# EAGLE schematic 6_channel_esp32_energy_meter_add-on (EAGLE 9.6.0)
CNAME: ATM90E32; CREVISION: 1.3 rev.1; DESIGNER: John deGlavina

## Sheet 1 of 3
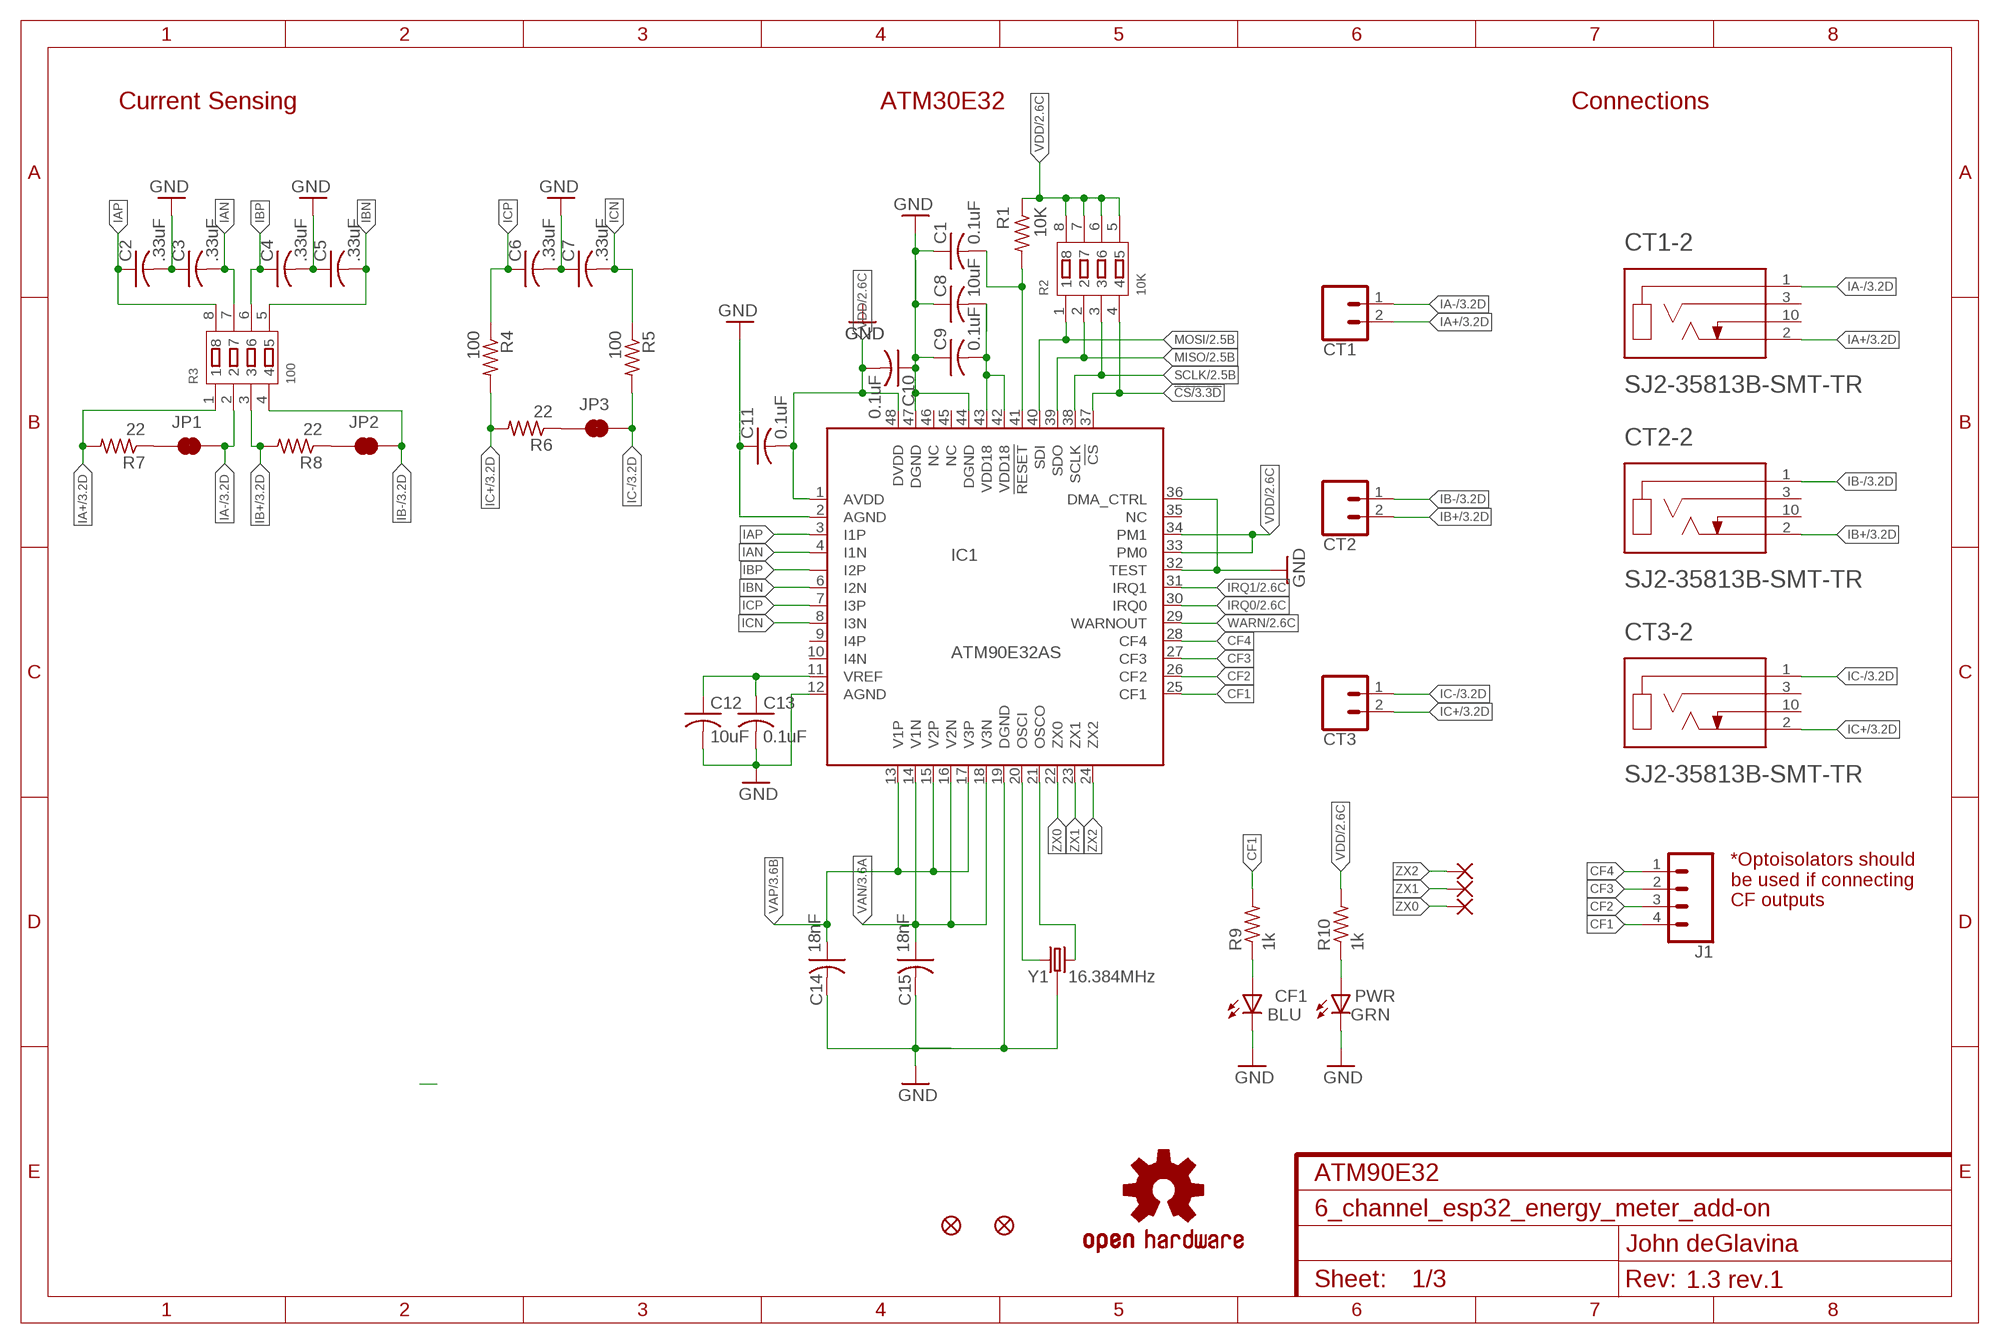
[diagram p0: schematic, sheet 1]

### Parts
C1  0.1uF  C-USC0603  [C0603]
C2  .33uF  C-USC0603  [C0603]
C3  .33uF  C-USC0603  [C0603]
C4  .33uF  C-USC0603  [C0603]
C5  .33uF  C-USC0603  [C0603]
C6  .33uF  C-USC0603  [C0603]
C7  .33uF  C-USC0603  [C0603]
C8  10uF  C-USC0603  [C0603]
C9  0.1uF  C-USC0603  [C0603]
C10  0.1uF  C-USC0603  [C0603]
C11  0.1uF  C-USC0603  [C0603]
C12  10uF  C-USC0603  [C0603]
C13  0.1uF  C-USC0603  [C0603]
C14  18nF  C-USC0603  [C0603]
C15  18nF  C-USC0603  [C0603]
CF1  BLU  LEDCHIPLED_0603  [CHIPLED_0603]
CT1  CONN_023.5MM  [SCREWTERMINAL-3.5MM-2]
CT1-2  SJ2-35813B-SMT-TR  [CUI_SJ2-35813B-SMT-TR]
CT2  CONN_023.5MM  [SCREWTERMINAL-3.5MM-2]
CT2-2  SJ2-35813B-SMT-TR  [CUI_SJ2-35813B-SMT-TR]
CT3  CONN_023.5MM  [SCREWTERMINAL-3.5MM-2]
CT3-2  SJ2-35813B-SMT-TR  [CUI_SJ2-35813B-SMT-TR]
FD1  FIDUCIALUFIDUCIAL  [FIDUCIAL-MICRO]
FD2  FIDUCIALUFIDUCIAL  [FIDUCIAL-MICRO]
IC1  ATM90E32AS  ATM90E36  [QFP50P900X900X120-48]
J1  CONN_04  [1X04]
JP1  JUMPER-SMT_2_NC_TRACE_SILK  [SMT-JUMPER_2_NC_TRACE_SILK]
JP2  JUMPER-SMT_2_NC_TRACE_SILK  [SMT-JUMPER_2_NC_TRACE_SILK]
JP3  JUMPER-SMT_2_NC_TRACE_SILK  [SMT-JUMPER_2_NC_TRACE_SILK]
LOGO1  OSHW-LOGOS  [OSHW-LOGO-S]
PWR  GRN  LEDCHIPLED_0603  [CHIPLED_0603]
R1  10K  R-US_R0603  [R0603]
R2  10K  SMD-RES-ARRAY-1K-4R(RA1206-8)  [RA1206-8]
R3  100  SMD-RES-ARRAY-1K-4R(RA1206-8)  [RA1206-8]
R4  100  R-US_R0603  [R0603]
R5  100  R-US_R0603  [R0603]
R6  22  R-US_R0603  [R0603]
R7  22  R-US_R0603  [R0603]
R8  22  R-US_R0603  [R0603]
R9  1k  R-US_R0603  [R0603]
R10  1k  R-US_R0603  [R0603]
Y1  16.384MHz  CRYSTAL-GROUNDEDSMD-3.2X2.5  [CRYSTAL-SMD-3.2X2.5MM]
ZX0  WIREPADSMD1,27-254  [SMD1,27-2,54]
ZX1  WIREPADSMD1,27-254  [SMD1,27-2,54]
ZX2  WIREPADSMD1,27-254  [SMD1,27-2,54]

### Nets
!CS: IC1.37(!CS) R2.4 ; also sheet 3
!RESET: C1.2 IC1.41(!RESET) R1.2
CF1: IC1.25(CF1) J1.4 R9.2
CF2: IC1.26(CF2) J1.3
CF3: IC1.27(CF3) J1.2
CF4: IC1.28(CF4) J1.1
GND: C1.1 C2.2 C3.1 C4.2 C5.1 C6.2 C7.1 C8.1 C9.1 C10.1 C11.1 C12.2 C13.2 C14.2 C15.2 CF1.C IC1.2(AGND) IC1.12(AGND) IC1.19(DGND) IC1.32(TEST) IC1.36(DMA_CTRL) IC1.44(DGND) IC1.47(DGND) PWR.C Y1.2 Y1.4 ; also sheet 2,3
IA+ [analog]: CT1-2.2(TIP) CT1.2 R3.1 R7.2 ; also sheet 3
IA- [analog]: CT1-2.1(SLEEVE) CT1.1 JP1.2 R3.2 ; also sheet 3
IAN [analog]: C3.2 IC1.4(I1N) R3.7
IAP [analog]: C2.1 IC1.3(I1P) R3.8
IB+ [analog]: CT2-2.2(TIP) CT2.2 R3.3 R8.2 ; also sheet 3
IB- [analog]: CT2-2.1(SLEEVE) CT2.1 JP2.2 R3.4 ; also sheet 3
IBN: C5.2 IC1.6(I2N) R3.5
IBP: C4.1 IC1.5(I2P) R3.6
IC+ [analog]: CT3-2.2(TIP) CT3.2 R4.2 R6.2 ; also sheet 3
IC- [analog]: CT3-2.1(SLEEVE) CT3.1 JP3.2 R5.2 ; also sheet 3
ICN [analog]: C7.2 IC1.8(I3N) R5.1
ICP [analog]: C6.1 IC1.7(I3P) R4.1
IRQ0: IC1.30(IRQ0) ; also sheet 2,3
IRQ1: IC1.31(IRQ1) ; also sheet 2,3
MISO: IC1.39(SDO) R2.2 ; also sheet 2,3
MOSI: IC1.40(SDI) R2.1 ; also sheet 2,3
N$1: JP1.1 R7.1
N$2: JP2.1 R8.1
N$3: CF1.A R9.1
N$4: JP3.1 R6.1
N$12: PWR.A R10.1
OSCI: IC1.20(OSCI) Y1.1
OSCO: IC1.21(OSCO) Y1.3
SCLK: IC1.38(SCLK) R2.3 ; also sheet 2,3
VAN: C15.1 IC1.14(V1N) IC1.16(V2N) IC1.18(V3N) ; also sheet 3
VAP [analog]: C14.1 IC1.13(V1P) IC1.15(V2P) IC1.17(V3P) ; also sheet 3
VDD [pwr]: C10.2 C11.2 IC1.1(AVDD) IC1.33(PM0) IC1.34(PM1) IC1.48(DVDD) R1.1 R2.5 R2.6 R2.7 R2.8 R10.2 ; also sheet 2,3
VDD18 [pwr]: C8.2 C9.2 IC1.42(VDD18) IC1.43(VDD18)
VREF: C12.1 C13.1 IC1.11(VREF)
WARN: IC1.29(WARNOUT) ; also sheet 2,3
ZX0: IC1.22(ZX0) ZX0.1(P)
ZX1: IC1.23(ZX1) ZX1.1(P)
ZX2: IC1.24(ZX2) ZX2.1(P)
Unconnected: CT1-2.3(RING) CT1-2.10(TIP_SWITCH) CT2-2.3(RING) CT2-2.10(TIP_SWITCH) CT3-2.3(RING) CT3-2.10(TIP_SWITCH) IC1.9(I4P) IC1.10(I4N) IC1.35(NC) IC1.45(NC) IC1.46(NC)

### Notes on the sheet
- Current Sensing | ATM30E32 | Connections
- *Optoisolators should 
  be used if connecting 
  CF outputs

## Sheet 2 of 3
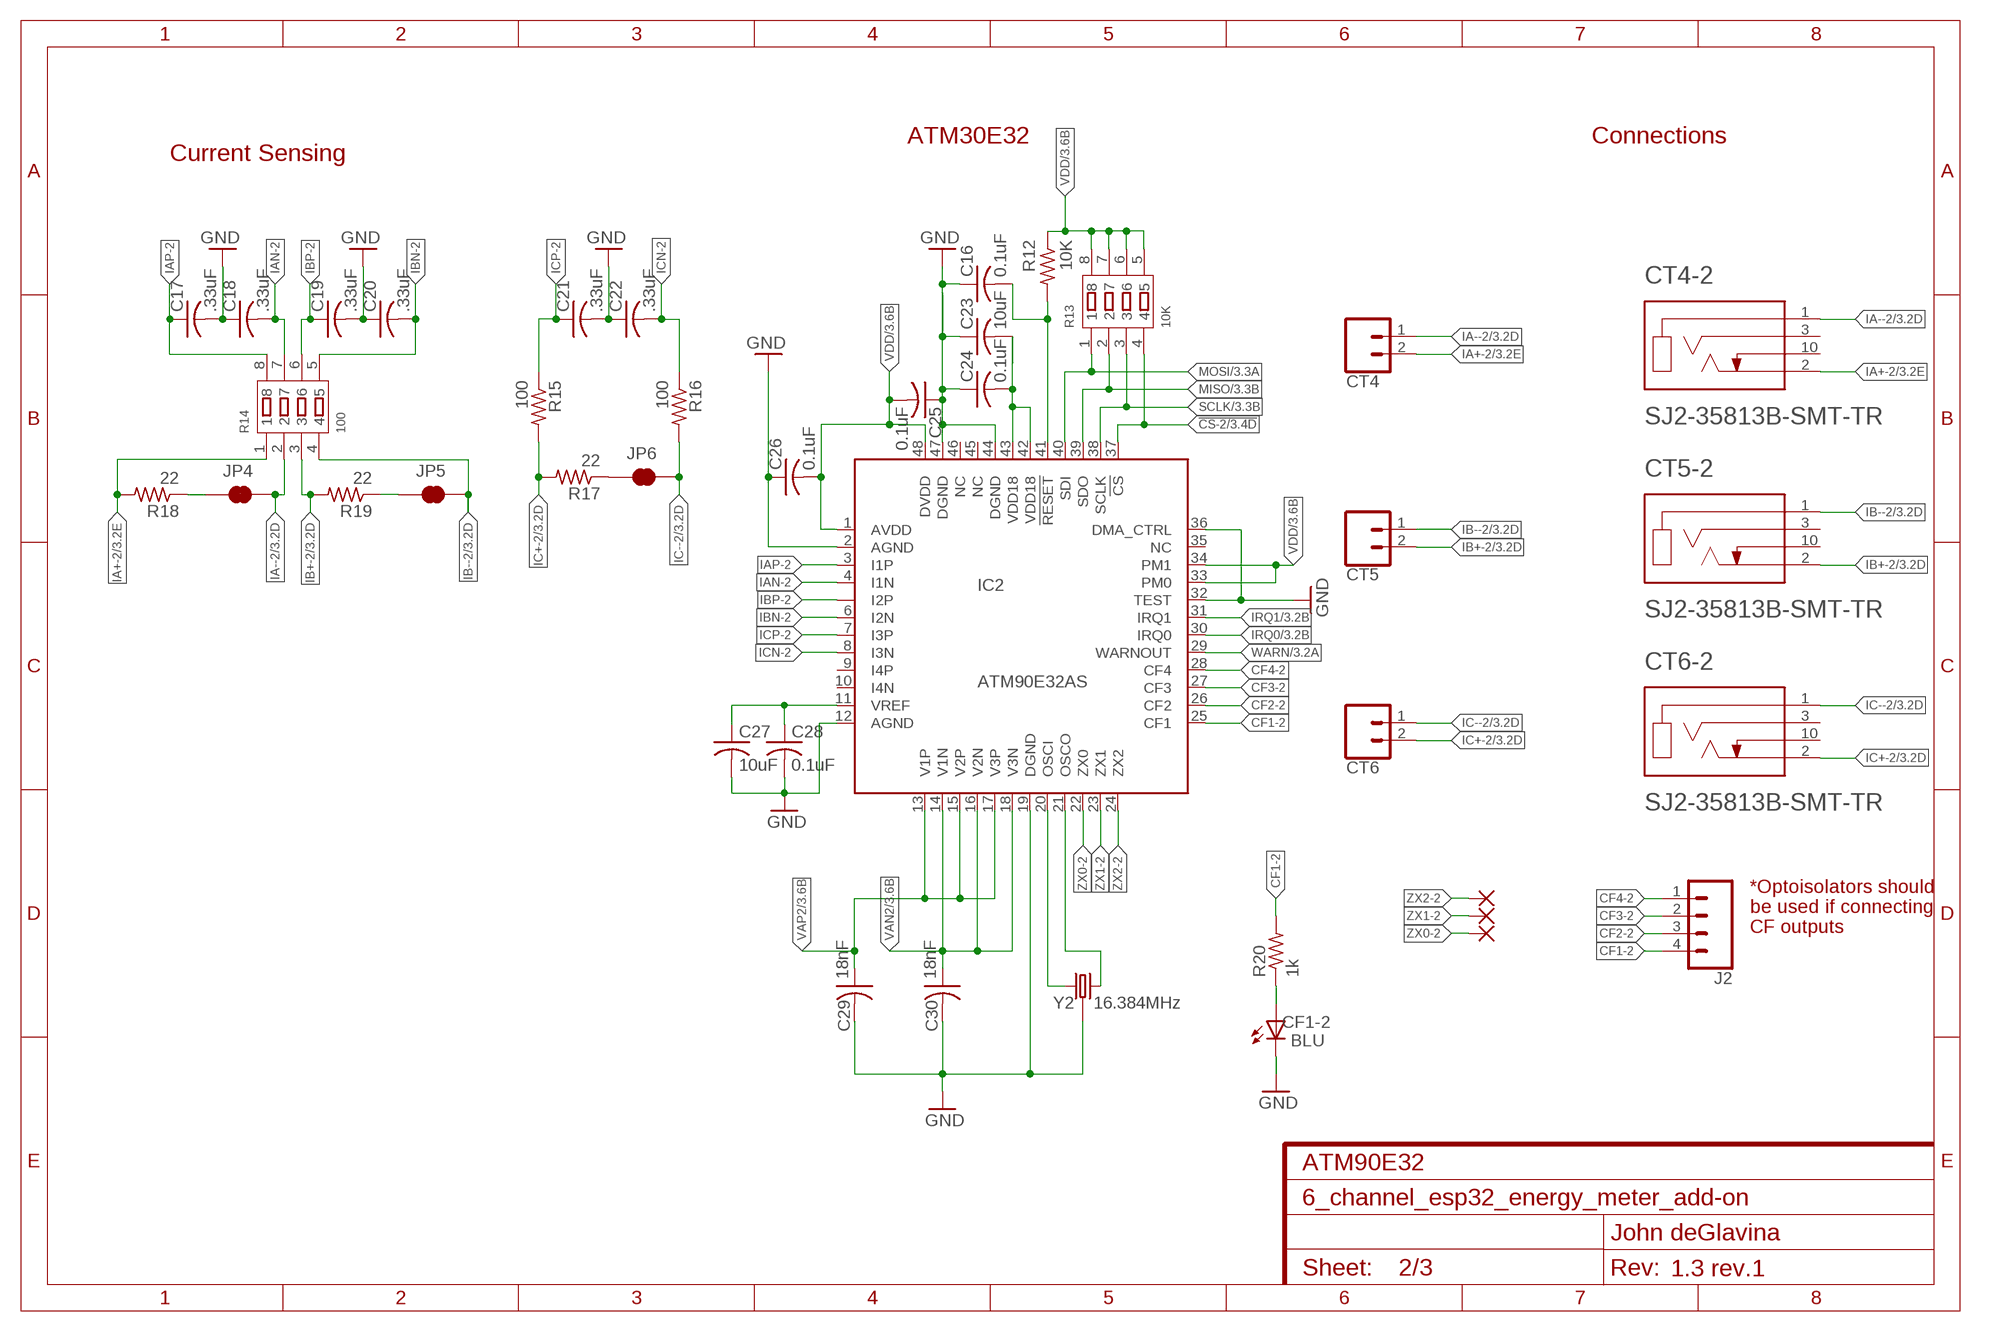
[diagram p1: schematic, sheet 2]

### Parts
C16  0.1uF  C-USC0603  [C0603]
C17  .33uF  C-USC0603  [C0603]
C18  .33uF  C-USC0603  [C0603]
C19  .33uF  C-USC0603  [C0603]
C20  .33uF  C-USC0603  [C0603]
C21  .33uF  C-USC0603  [C0603]
C22  .33uF  C-USC0603  [C0603]
C23  10uF  C-USC0603  [C0603]
C24  0.1uF  C-USC0603  [C0603]
C25  0.1uF  C-USC0603  [C0603]
C26  0.1uF  C-USC0603  [C0603]
C27  10uF  C-USC0603  [C0603]
C28  0.1uF  C-USC0603  [C0603]
C29  18nF  C-USC0603  [C0603]
C30  18nF  C-USC0603  [C0603]
CF1-2  BLU  LEDCHIPLED_0603  [CHIPLED_0603]
CT4  CONN_023.5MM  [SCREWTERMINAL-3.5MM-2]
CT4-2  SJ2-35813B-SMT-TR  [CUI_SJ2-35813B-SMT-TR]
CT5  CONN_023.5MM  [SCREWTERMINAL-3.5MM-2]
CT5-2  SJ2-35813B-SMT-TR  [CUI_SJ2-35813B-SMT-TR]
CT6  CONN_023.5MM  [SCREWTERMINAL-3.5MM-2]
CT6-2  SJ2-35813B-SMT-TR  [CUI_SJ2-35813B-SMT-TR]
IC2  ATM90E32AS  ATM90E36  [QFP50P900X900X120-48]
J2  CONN_04  [1X04]
JP4  JUMPER-SMT_2_NC_TRACE_SILK  [SMT-JUMPER_2_NC_TRACE_SILK]
JP5  JUMPER-SMT_2_NC_TRACE_SILK  [SMT-JUMPER_2_NC_TRACE_SILK]
JP6  JUMPER-SMT_2_NC_TRACE_SILK  [SMT-JUMPER_2_NC_TRACE_SILK]
R12  10K  R-US_R0603  [R0603]
R13  10K  SMD-RES-ARRAY-1K-4R(RA1206-8)  [RA1206-8]
R14  100  SMD-RES-ARRAY-1K-4R(RA1206-8)  [RA1206-8]
R15  100  R-US_R0603  [R0603]
R16  100  R-US_R0603  [R0603]
R17  22  R-US_R0603  [R0603]
R18  22  R-US_R0603  [R0603]
R19  22  R-US_R0603  [R0603]
R20  1k  R-US_R0603  [R0603]
Y2  16.384MHz  CRYSTAL-GROUNDEDSMD-3.2X2.5  [CRYSTAL-SMD-3.2X2.5MM]
ZX0-2  WIREPADSMD1,27-254  [SMD1,27-2,54]
ZX1-2  WIREPADSMD1,27-254  [SMD1,27-2,54]
ZX2-2  WIREPADSMD1,27-254  [SMD1,27-2,54]

### Nets
!CS-2: IC2.37(!CS) R13.4 ; also sheet 3
!RESET2: C16.2 IC2.41(!RESET) R12.2
CF1-2: IC2.25(CF1) J2.4 R20.2
CF2-2: IC2.26(CF2) J2.3
CF3-2: IC2.27(CF3) J2.2
CF4-2: IC2.28(CF4) J2.1
GND: C16.1 C17.2 C18.1 C19.2 C20.1 C21.2 C22.1 C23.1 C24.1 C25.1 C26.1 C27.2 C28.2 C29.2 C30.2 CF1-2.C IC2.2(AGND) IC2.12(AGND) IC2.19(DGND) IC2.32(TEST) IC2.36(DMA_CTRL) IC2.44(DGND) IC2.47(DGND) Y2.2 Y2.4 ; also sheet 1,3
IA+-2 [analog]: CT4-2.2(TIP) CT4.2 R14.1 R18.2 ; also sheet 3
IA--2 [analog]: CT4-2.1(SLEEVE) CT4.1 JP4.2 R14.2 ; also sheet 3
IAN-2 [analog]: C18.2 IC2.4(I1N) R14.7
IAP-2 [analog]: C17.1 IC2.3(I1P) R14.8
IB+-2 [analog]: CT5-2.2(TIP) CT5.2 R14.3 R19.2 ; also sheet 3
IB--2 [analog]: CT5-2.1(SLEEVE) CT5.1 JP5.2 R14.4 ; also sheet 3
IBN-2: C20.2 IC2.6(I2N) R14.5
IBP-2: C19.1 IC2.5(I2P) R14.6
IC+-2 [analog]: CT6-2.2(TIP) CT6.2 R15.2 R17.2 ; also sheet 3
IC--2 [analog]: CT6-2.1(SLEEVE) CT6.1 JP6.2 R16.2 ; also sheet 3
ICN-2 [analog]: C22.2 IC2.8(I3N) R16.1
ICP-2 [analog]: C21.1 IC2.7(I3P) R15.1
IRQ0: IC2.30(IRQ0) ; also sheet 1,3
IRQ1: IC2.31(IRQ1) ; also sheet 1,3
MISO: IC2.39(SDO) R13.2 ; also sheet 1,3
MOSI: IC2.40(SDI) R13.1 ; also sheet 1,3
N$5: JP4.1 R18.1
N$6: JP5.1 R19.1
N$7: JP6.1 R17.1
N$14: CF1-2.A R20.1
OSCI2: IC2.20(OSCI) Y2.1
OSCO2: IC2.21(OSCO) Y2.3
SCLK: IC2.38(SCLK) R13.3 ; also sheet 1,3
VAN2: C30.1 IC2.14(V1N) IC2.16(V2N) IC2.18(V3N) ; also sheet 3
VAP2 [analog]: C29.1 IC2.13(V1P) IC2.15(V2P) IC2.17(V3P) ; also sheet 3
VDD [pwr]: C25.2 C26.2 IC2.1(AVDD) IC2.33(PM0) IC2.34(PM1) IC2.48(DVDD) R12.1 R13.5 R13.6 R13.7 R13.8 ; also sheet 1,3
VDD2 [pwr]: C23.2 C24.2 IC2.42(VDD18) IC2.43(VDD18)
VREF2: C27.1 C28.1 IC2.11(VREF)
WARN: IC2.29(WARNOUT) ; also sheet 1,3
ZX0-2: IC2.22(ZX0) ZX0-2.1(P)
ZX1-2: IC2.23(ZX1) ZX1-2.1(P)
ZX2-2: IC2.24(ZX2) ZX2-2.1(P)
Unconnected: CT4-2.3(RING) CT4-2.10(TIP_SWITCH) CT5-2.3(RING) CT5-2.10(TIP_SWITCH) CT6-2.3(RING) CT6-2.10(TIP_SWITCH) IC2.9(I4P) IC2.10(I4N) IC2.35(NC) IC2.45(NC) IC2.46(NC)

### Notes on the sheet
- ATM30E32 | Connections
- Current Sensing
- *Optoisolators should 
  be used if connecting 
  CF outputs

## Sheet 3 of 3
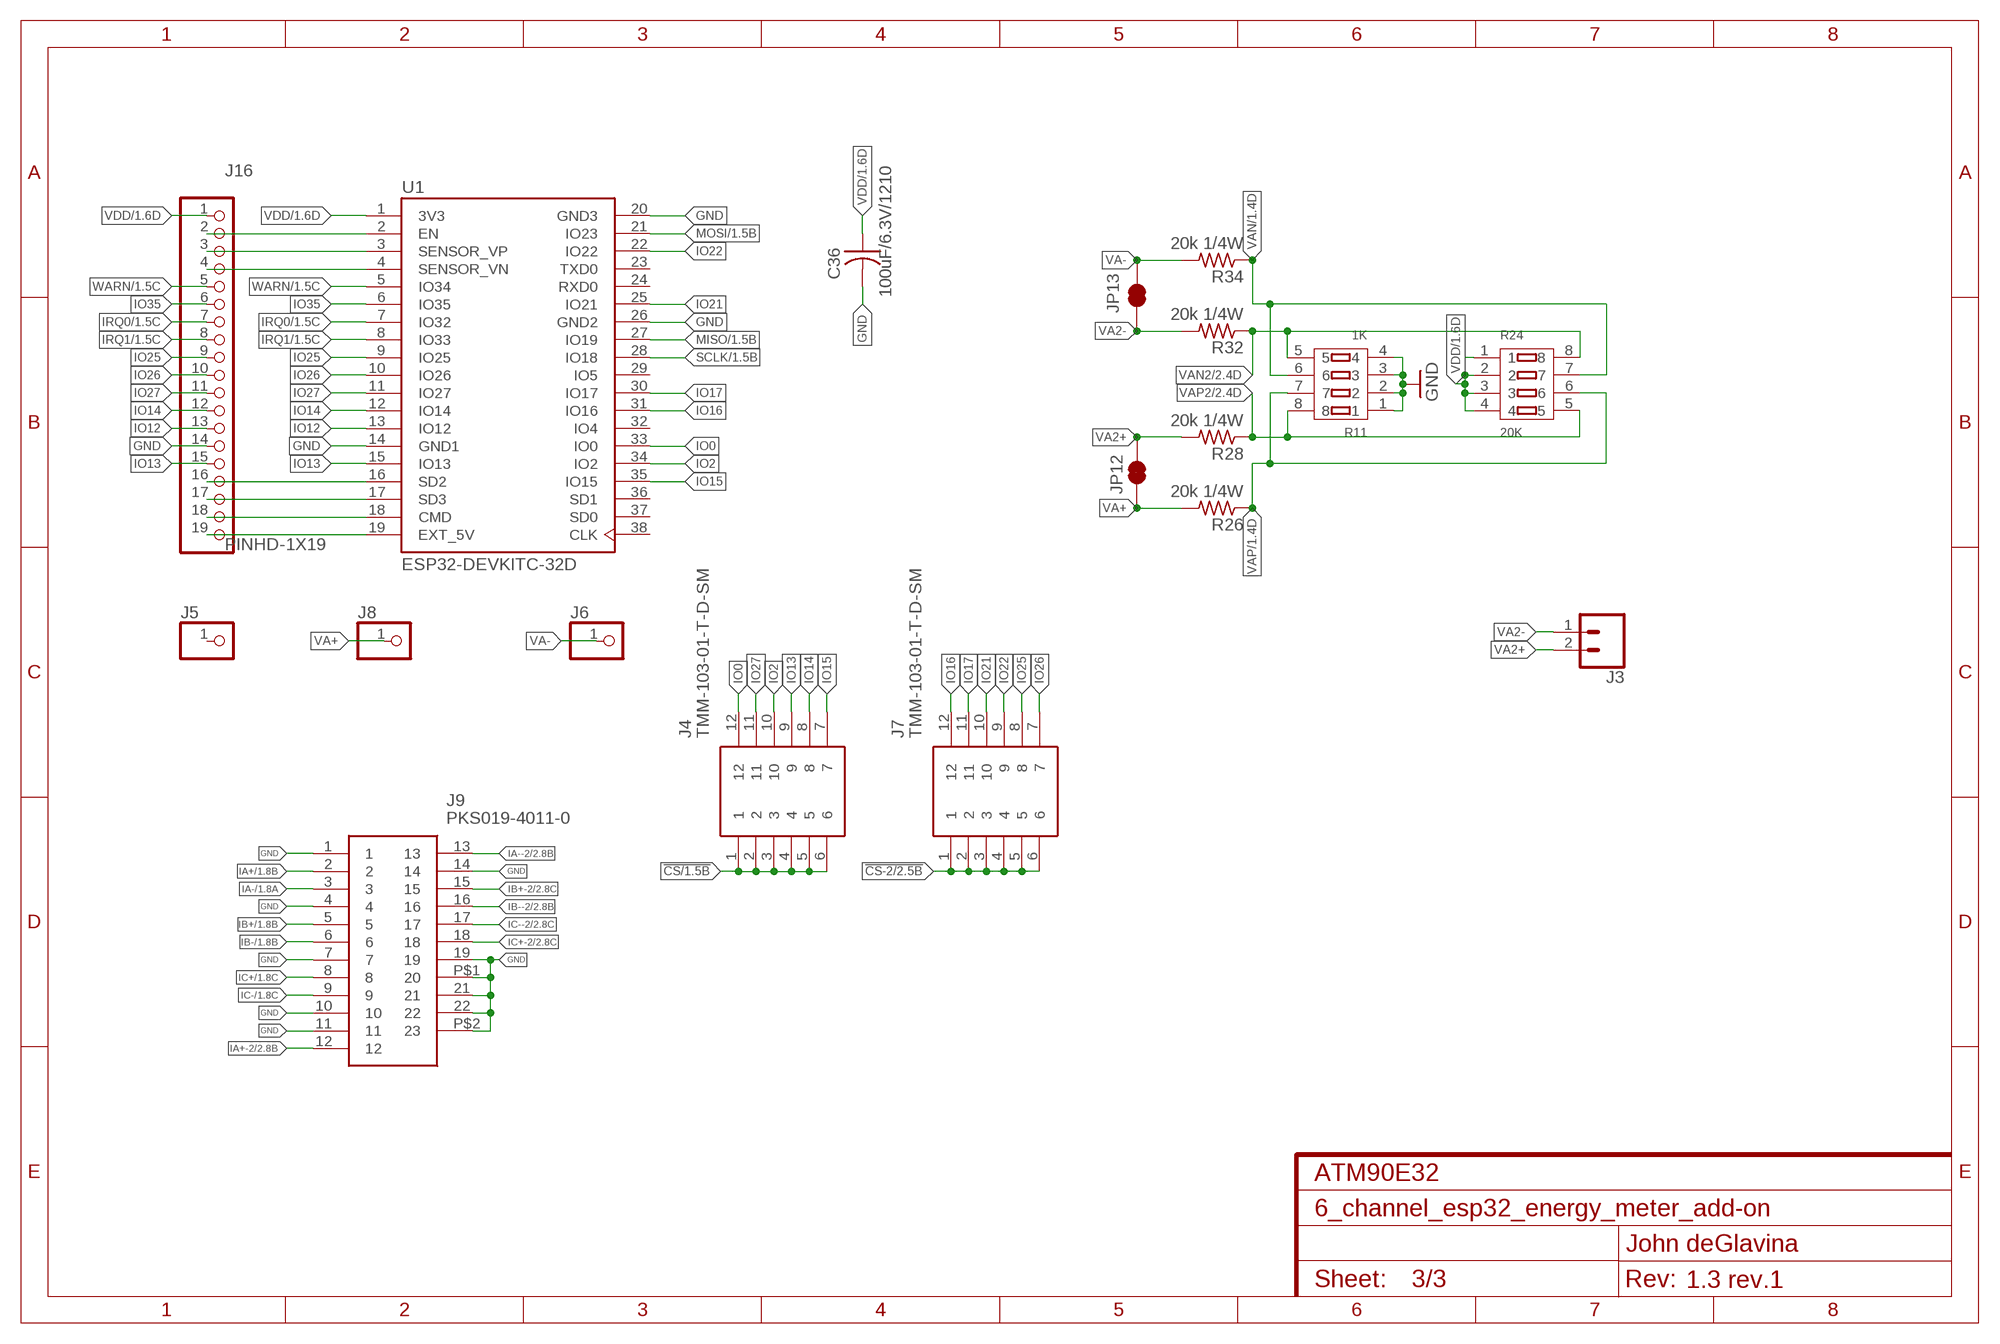
[diagram p2: schematic, sheet 3]

### Parts
C36  100uF/6.3V/1210  C-USC1210  [C1210]
J3  CONN_023.5MM  [SCREWTERMINAL-3.5MM-2]
J4  TMM-103-01-T-D-SM  [SOP200P706X597-12N]
J5  PINHD1X1-SM1X01_SM  [1X01-SM]
J6  PINHD1X1-SM1X01_SM  [1X01-SM]
J7  TMM-103-01-T-D-SM  [SOP200P706X597-12N]
J8  PINHD1X1-SM1X01_SM  [1X01-SM]
J9  PKS019-4011-0  [PKS01940110]
J16  PINHD-1X19  [1X19]
JP12  JUMPER-SMT_2_NC_TRACE_SILK  [SMT-JUMPER_2_NC_TRACE_SILK]
JP13  JUMPER-SMT_2_NC_TRACE_SILK  [SMT-JUMPER_2_NC_TRACE_SILK]
R11  1K  SMD-RES-ARRAY-1K-4R(RA1206-8)  [RA1206-8]
R24  20K  SMD-RES-ARRAY-1K-4R(RA1206-8)  [RA1206-8]
R26  20k 1/4W  R-US_R0603  [R0603]
R28  20k 1/4W  R-US_R0603  [R0603]
R32  20k 1/4W  R-US_R0603  [R0603]
R34  20k 1/4W  R-US_R0603  [R0603]
U1  ESP32-DEVKITC-32D  [MODULE_ESP32-DEVKITC-32D]

### Nets
!CS: J4.1 J4.2 J4.3 J4.4 J4.5 J4.6 ; also sheet 1
!CS-2: J7.1 J7.2 J7.3 J7.4 J7.5 J7.6 ; also sheet 2
GND: C36.2 J9.1 J9.4 J9.7 J9.10 J9.11 J9.14 J9.19 J9.21 J9.22 J9.P$1 J9.P$2 J16.14 R11.1 R11.2 R11.3 R11.4 U1.14(GND1) U1.20(GND3) U1.26(GND2) ; also sheet 1,2
IA+ [analog]: J9.2 ; also sheet 1
IA+-2 [analog]: J9.12 ; also sheet 2
IA- [analog]: J9.3 ; also sheet 1
IA--2 [analog]: J9.13 ; also sheet 2
IB+ [analog]: J9.5 ; also sheet 1
IB+-2 [analog]: J9.15 ; also sheet 2
IB- [analog]: J9.6 ; also sheet 1
IB--2 [analog]: J9.16 ; also sheet 2
IC+ [analog]: J9.8 ; also sheet 1
IC+-2 [analog]: J9.18 ; also sheet 2
IC- [analog]: J9.9 ; also sheet 1
IC--2 [analog]: J9.17 ; also sheet 2
IO0: J4.12 U1.33(IO0)
IO2: J4.10 U1.34(IO2)
IO12: J16.13 U1.13(IO12)
IO13: J4.9 J16.15 U1.15(IO13)
IO14: J4.8 J16.12 U1.12(IO14)
IO15: J4.7 U1.35(IO15)
IO16: J7.12 U1.31(IO16)
IO17: J7.11 U1.30(IO17)
IO21: J7.10 U1.25(IO21)
IO22: J7.9 U1.22(IO22)
IO25: J7.8 J16.9 U1.9(IO25)
IO26: J7.7 J16.10 U1.10(IO26)
IO27: J4.11 J16.11 U1.11(IO27)
IO35: J16.6 U1.6(IO35)
IRQ0: J16.7 U1.7(IO32) ; also sheet 1,2
IRQ1: J16.8 U1.8(IO33) ; also sheet 1,2
MISO: U1.27(IO19) ; also sheet 1,2
MOSI: U1.21(IO23) ; also sheet 1,2
N$8: J16.2 U1.2(EN)
N$9: J16.3 U1.3(SENSOR_VP)
N$15: J16.4 U1.4(SENSOR_VN)
N$16: J16.16 U1.16(SD2)
N$17: J16.17 U1.17(SD3)
N$18: J16.18 U1.18(CMD)
N$19: J16.19 U1.19(EXT_5V)
SCLK: U1.28(IO18) ; also sheet 1,2
VA2+: J3.2 JP12.1 R28.2
VA2-: J3.1 JP13.1 R32.2
VA+: J8.1 JP12.2 R26.2
VA-: J6.1 JP13.2 R34.2
VAN: R11.6 R24.7 R34.1 ; also sheet 1
VAN2: R11.5 R24.8 R32.1 ; also sheet 2
VAP [analog]: R11.7 R24.6 R26.1 ; also sheet 1
VAP2 [analog]: R11.8 R24.5 R28.1 ; also sheet 2
VDD [pwr]: C36.1 J16.1 R24.1 R24.2 R24.3 R24.4 U1.1(3V3) ; also sheet 1,2
WARN: J16.5 U1.5(IO34) ; also sheet 1,2
Unconnected: J5.1 U1.23(TXD0) U1.24(RXD0) U1.29(IO5) U1.32(IO4) U1.36(SD1) U1.37(SD0) U1.38(CLK)

## Library data of the parts
C1-C30 C36 = rcl:C-US: CAPACITOR, American symbol; SPICEPREFIX: C
CF1 CF1-2 PWR = adafruit:LED: LED OSRAM: - CHIPLED LG R971, LG N971, LY N971, LG Q971, LY Q971, LO R971, LY R971 LH N974, LH R974 LS Q976, LO Q976, LY Q976 LO Q996 - Hyper CHIPLED LW Q18S LB Q993, LB Q99A, LB R99A - SideLED LS A670, LO A670, LY A670, LG A670, LP A670 LB A673, LV A673, LT A673, LW A673 LH A674 LY A675 LS A676, LA A676, LO A676, LY A676, LW A676 LS A679, LY A679, LG A679 - Hyper Micro SIDELED® LS Y876, LA Y876, LO Y876, LY Y876 LT Y87S - SmartLED LW L88C, LW L88S LB L89C, LB L89S, LG L890 LS L89K, LO L89K, LY L89K LS L896, LA L896, LO L896, LY L896 - TOPLED LS T670, LO T670, LY T670, LG T670, LP T670 LSG T670, LSP T670, LSY T670, LOP T670, LYG T670 LG T671, LOG T671, LSG T671 LB T673, LV T673, LT T673, LW T673 LH T674 LS T676, LA T676, LO T676, LY T676, LB T676, LH T676, LSB T676, LW T676 LB T67C, LV T67C, LT T67C, LS T67K, LO T67K, LY T67K, LW E67C LS E67B, LA E67B, LO E67B, LY E67B, LB E67C, LV E67C, LT E67C LW T67C LS T679, LY T679, LG T679 LS T770, LO T770, LY T770, LG T770, LP T770 LB T773, LV T773, LT T773, LW T773 LH T774 LS E675, LA E675, LY E675, LS T675 LS T776, LA T776, LO T776, LY T776, LB T776 LHGB T686 LT T68C, LB T68C - Hyper Mini TOPLED® LB M676 - Mini TOPLED Santana® LG M470 LS M47K, LO M47K, LY M47K Source: http://www.osram.convergy.de/
CT1-CT6 J3 = SparkFun-Connectors:CONN_02: Multi connection point. Often used as Generic Header-pin footprint for 0.1 inch spaced/style header connections On any of the 0.1 inch spaced packages, you can populate with these: Break Away Headers - Straight <https://www.sparkfun.com/products/116> (PRT-00116) Break Away Male Headers - Right Angle <https://www.sparkfun.com/products/553> (PRT-00553) Female Headers <https://www.sparkfun.com/products/115> (PRT-00115) Break Away Headers - Machine Pin <https://www.sparkfun.com/products/117> (PRT-00117) Break Away Female Headers - Swiss Machine Pin <https://www.sparkfun.com/products/743> (PRT-00743) For SCREWTERMINALS and SPRING TERMINALS visit here: Screw Terimnals on SparkFun.com <https://www.sparkfun.com/search/results?term=Screw+Terminals> (5mm/3.5mm/2.54mm spacing) This device is also useful as a general connection point to wire up your design to another part of your project. Our various solder wires solder well into these plated through hole pads. Hook-Up Wire - Assortment (Stranded, 22 AWG) <https://www.sparkfun.com/products/11375> (PRT-11375) Hook-Up Wire - Assortment (Solid Core, 22 AWG) <https://www.sparkfun.com/products/11367> (PRT-11367) View the entire wire category on our website here <https://www.sparkfun.com/categories/141> Special notes: Molex polarized connector foot print use with: PRT-08233 with associated crimp pins and housings. 2.54_SCREWTERM for use with PRT-10571. 3.5mm Screw Terminal footprints for PRT-08084 5mm Screw Terminal footprints for use with PRT-08432; PROD_ID: CONN-08399
CT1-2 CT2-2 CT3-2 CT4-2 CT5-2 CT6-2 = SJ2-35813B-SMT-TR:SJ2-35813B-SMT-TR: 3 conductors, 3.5mm, SMT Audio Jack w/ Tip Switch; MANUFACTURER: CUI; MPN: SJ2-35813B-SMT-TR; PART_REV: 1.01; STANDARD: Manufacturer recommendation
FD1 FD2 = SparkFun-Aesthetics:FIDUCIAL: Fiducial Alignment Points Point-of-reference for pick-and-place machines and other optical instruments.
IC1 IC2 = ATM90E36:ATM90E36: ATMEL Poly-phase energy metering; OC_FARNELL: unknown; OC_NEWARK: unknown; SPICEPREFIX: X
J1 J2 = SparkFun-Connectors:CONN_04: Multi connection point. Often used as Generic Header-pin footprint for 0.1 inch spaced/style header connections On any of the 0.1 inch spaced packages, you can populate with these: Break Away Headers - Straight <https://www.sparkfun.com/products/116> (PRT-00116) Break Away Male Headers - Right Angle <https://www.sparkfun.com/products/553> (PRT-00553) Female Headers <https://www.sparkfun.com/products/115> (PRT-00115) Break Away Headers - Machine Pin <https://www.sparkfun.com/products/117> (PRT-00117) Break Away Female Headers - Swiss Machine Pin <https://www.sparkfun.com/products/743> (PRT-00743) For SCREWTERMINALS and SPRING TERMINALS visit here: Screw Terimnals on SparkFun.com <https://www.sparkfun.com/search/results?term=Screw+Terminals> (5mm/3.5mm/2.54mm spacing) This device is also useful as a general connection point to wire up your design to another part of your project. Our various solder wires solder well into these plated through hole pads. Hook-Up Wire - Assortment (Stranded, 22 AWG) <https://www.sparkfun.com/products/11375> (PRT-11375) Hook-Up Wire - Assortment (Solid Core, 22 AWG) <https://www.sparkfun.com/products/11367> (PRT-11367) View the entire wire category on our website here <https://www.sparkfun.com/categories/141> Special notes: Molex polarized connector foot print use with SKU : PRT-08231 with associated crimp pins and housings. 1MM SMD Version SKU: PRT-10208; PROD_ID: CONN-09696
J4 J7 = SamacSys_Parts:TMM-103-01-T-D-SM: Conn Unshrouded Header HDR 6 POS 2mm Solder ST SMD Automotive Tube Source: Datasheet <https://www.arrow.com/en/products/tmm-103-01-t-d-sm/samtec>; DESCRIPTION: Conn Unshrouded Header HDR 6 POS 2mm Solder ST SMD Automotive Tube; HEIGHT: 5.97mm; MANUFACTURER_NAME: SAMTEC; MANUFACTURER_PART_NUMBER: TMM-103-01-T-D-SM
J5 J6 J8 = adafruit:PINHD1X1-SM
J9 = SamacSys_Parts:PKS019-4011-0: HDMI, Displayport & DVI Connectors Type D HDMI SMT Sngl Row Cnt Design Source: Datasheet <https://www.mouser.com/catalog/specsheets/PKS019-4011-0 Drawing.pdf>; DESCRIPTION: HDMI, Displayport & DVI Connectors Type D HDMI SMT Sngl Row Cnt Design; HEIGHT: 3.27mm; MANUFACTURER_NAME: Yamaichi; MANUFACTURER_PART_NUMBER: PKS019-4011-0; MOUSER_PART_NUMBER: 945-PKS019-4011-0; MOUSER_PRICE-STOCK: https://www.mouser.com/Search/Refine.aspx?Keyword=945-PKS019-4011-0
J16 = adafruit:PINHD-1X19; SPICEPREFIX: X
JP1-JP6 JP12 JP13 = SparkFun-Jumpers:JUMPER-SMT_2_NC_TRACE: Normally closed trace jumper This jumper has a trace between two pads so it's normally closed (NC). Use a razor knife to open the connection. For best results follow the IPC guidelines for cutting traces: Cutout at least 0.063 mm (0.005 in). Remove all loose material to clean up the cut area. Seal the cut with an approved epoxy. Reapply solder to reclose the connection.
LOGO1 = SparkFun-Aesthetics:OSHW-LOGO: Open-Source Hardware (OSHW) Logo This logo indicates the piece of hardware it is found on incorporates a OSHW license and/or adheres to the definition of open source hardware found here: http://freedomdefined.org/OSHW
R1 R4-R10 R12 R15-R20 R26 R28 R32 R34 = rcl:R-US_: RESISTOR, American symbol; SPICEPREFIX: R
R2 R3 R13 R14 R24 = Seeed-Resistor-2016:SMD-RES-ARRAY-1K-4R(RA1206-8): 301030012; MPN: Chip-Array-Series-1%; VALUE: 1K
R11 = Seeed-Resistor-2016:SMD-RES-ARRAY-1K-4R(RA1206-8): 301030012; MPN: Chip-Array-Series-1%
U1 = ESP32-DEVKITC-32D:ESP32-DEVKITC-32D: Eval Board For Esp-Wroom-32; AVAILABILITY: Unavailable; DESCRIPTION: Eval Board For Esp-Wroom-32; MF: Espressif Systems; MP: ESP32-DEVKITC-32D; PACKAGE: None; PRICE: None
Y1 Y2 = SparkFun-Clocks:CRYSTAL-GROUNDED: Crystals w/ Ground Pin (Generic) These are passive quartz crystals, which can be used as a clock source for a microcontroller. Crystal's are usually two-terminal devices. A third terminal may be optionally connected to ground, as recommended by the manufaturer.
ZX0 ZX0-2 ZX1 ZX1-2 ZX2 ZX2-2 = wirepad:WIREPAD: Wire PAD connect wire on PCB

## Net classes
0 default: width 0.152 mm, drill 0.33 mm, clearance 0.152 mm
1 pwr: width 0.305 mm, drill 0.356 mm, clearance 0.152 mm
2 analog: width 0.203 mm, drill 0.33 mm, clearance 0.152 mm